# Altium schematic sheet Qbot2.SchDoc
size A3
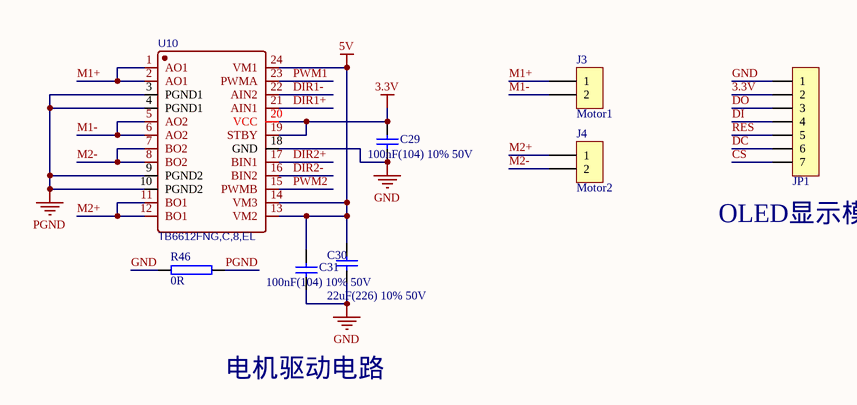
[diagram p0: Qbot2.SchDoc]

## Parts
C29  100nF(104) 10% 50V  [LC-0805_C]
C30  22uF(226) 10% 50V  [CD B(3528)]
C31  100nF(104) 10% 50V  [LC-0805_C]
J3  Motor1  [CONN-TH_1.25T-2A_1.25T-2A]
J4  Motor2  [CONN-TH_1.25T-2A_1.25T-2A]
JP1  HDR-1X7  [HDR2.54-M-LI-7P]  (value not drawn)
R46  0R  [LC-0805_R]
U10  TB6612FNG,C,8,EL  [SSOP24]

## Nets
3.3V: C29.2 JP1.2 U10.19(STBY) U10.20(VCC)
5V: C30.2 C31.2 U10.13(VM2) U10.14(VM3) U10.24(VM1)
GND: C29.1 C30.1 C31.1 JP1.1 R46.1 U10.18(GND)
PGND: R46.2 U10.3(PGND1) U10.4(PGND1) U10.9(PGND2) U10.10(PGND2)
CS: JP1.7
DC: JP1.6
DI: JP1.4
DIR1+: U10.21(AIN1)
DIR1-: U10.22(AIN2)
DIR2+: U10.17(BIN1)
DIR2-: U10.16(BIN2)
DO: JP1.3
M1+: J3.1 U10.1(AO1) U10.2(AO1)
M1-: J3.2 U10.5(AO2) U10.6(AO2)
M2+: J4.1 U10.11(BO1) U10.12(BO1)
M2-: J4.2 U10.7(BO2) U10.8(BO2)
PWM1: U10.23(PWMA)
PWM2: U10.15(PWMB)
RES: JP1.5

## Notes on the sheet
- (near JP1) OLED显示模块
- 电机驱动电路

## Library data of the parts
C29-C31 = 0805 100nF(104) 10% 50V: 贴片电容; ComponentLink1Description: 供应商链接; ComponentLink1URL: http://www.szlcsc.com/product/details_50686.html; Package: 0805; Supplier: LC; SuppliersPartNumber: C49678
J3 J4 = SIP2: jointbar
JP1 = Header 7: 7P接插件; 版权归属: 源创客; BOM名称: 7P接插件; 学习资源: www.ooocke.com
R46 = RES
U10 = TB6612FNG,C,8,EL: BOM_Manufacturer: TOSHIBA; Contributor: LCSC; BOM_Supplier: LCSC; BOM_Manufacturer Part: TB6612FNG,C,8,EL; BOM_Supplier Part: C141517; BOM_JLCPCB Part Class: Extended Part; spicePre: U; spiceSymbolName: TB6612FNG,C,8,EL